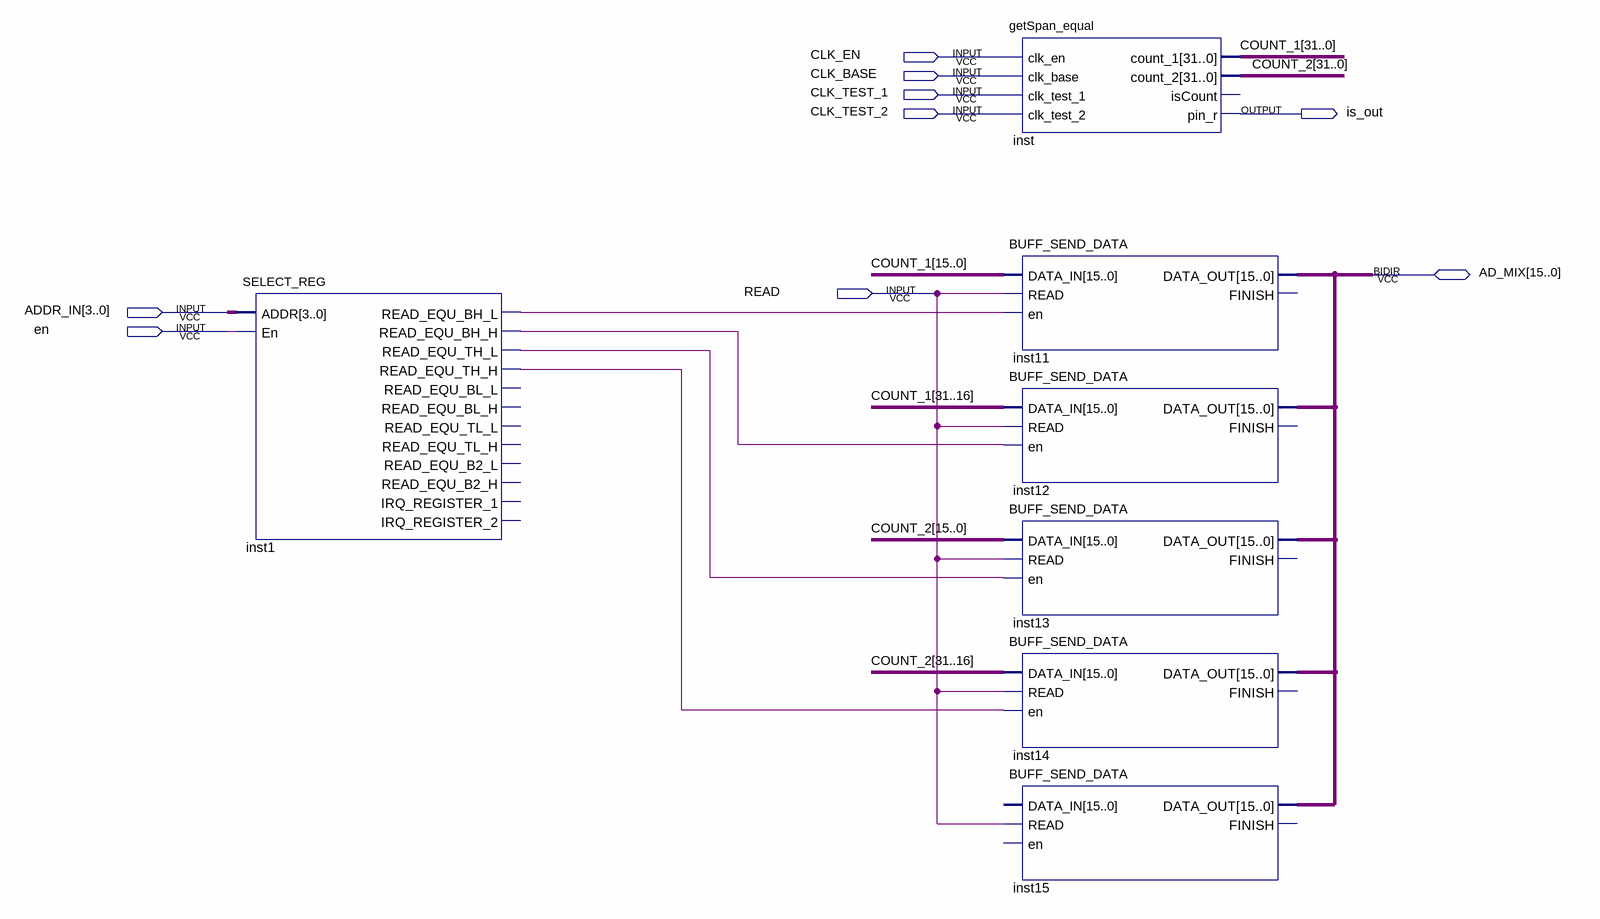
[diagram p0: schematic sheet]
// Quartus schematic Spans.bdf as structural Verilog: 7 symbols, 9 pins
module Spans (
  input  CLK_EN,
  input  CLK_BASE,
  input  CLK_TEST_1,
  input  CLK_TEST_2,
  input  READ,
  input  [3:0] ADDR_IN,
  input  en,
  inout  [15:0] AD_MIX,
  output is_out
);

  wire inst1_read_equ_bh_h, inst1_read_equ_bh_l, inst1_read_equ_th_h, inst1_read_equ_th_l;
  wire [31:0] COUNT_1, COUNT_2;

  SELECT_REG inst1 (
    .ADDR(ADDR_IN), .En(en), .READ_EQU_BH_L(inst1_read_equ_bh_l), .READ_EQU_BH_H(inst1_read_equ_bh_h),
    .READ_EQU_TH_L(inst1_read_equ_th_l), .READ_EQU_TH_H(inst1_read_equ_th_h));  // open: READ_EQU_BL_L, READ_EQU_BL_H, READ_EQU_TL_L, READ_EQU_TL_H, READ_EQU_B2_L, READ_EQU_B2_H, IRQ_REGISTER_1, IRQ_REGISTER_2
  getSpan_equal inst (
    .clk_en(CLK_EN), .clk_base(CLK_BASE), .clk_test_1(CLK_TEST_1), .clk_test_2(CLK_TEST_2),
    .count_1(COUNT_1), .count_2(COUNT_2), .pin_r(is_out));  // open: isCount
  BUFF_SEND_DATA inst11 (
    .DATA_IN(COUNT_1[15:0]), .READ(READ), .en(inst1_read_equ_bh_l), .DATA_OUT(AD_MIX));  // open: FINISH
  BUFF_SEND_DATA inst12 (
    .DATA_IN(COUNT_1[31:16]), .READ(READ), .en(inst1_read_equ_bh_h), .DATA_OUT(AD_MIX));  // open: FINISH
  BUFF_SEND_DATA inst13 (
    .DATA_IN(COUNT_2[15:0]), .READ(READ), .en(inst1_read_equ_th_l), .DATA_OUT(AD_MIX));  // open: FINISH
  BUFF_SEND_DATA inst14 (
    .DATA_IN(COUNT_2[31:16]), .READ(READ), .en(inst1_read_equ_th_h), .DATA_OUT(AD_MIX));  // open: FINISH
  BUFF_SEND_DATA inst15 (.READ(READ), .DATA_OUT(AD_MIX));  // open: DATA_IN, en, FINISH
endmodule
